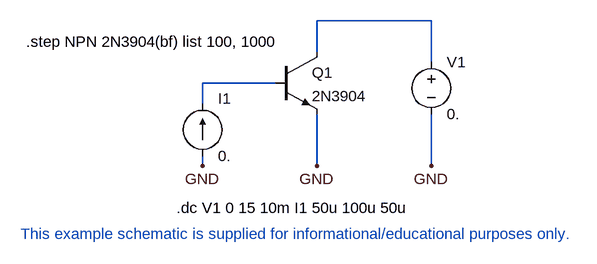
[diagram p0: schematic StepBeta.asc]
StepBeta.asc, the LTspice schematic file:
Version 4
SHEET 1 2488 1528
WIRE 1984 1376 1984 1296
WIRE 1984 1200 1984 1152
WIRE 1984 1152 2160 1152
WIRE 2160 1152 2160 1216
WIRE 2160 1296 2160 1376
WIRE 1808 1280 1808 1248
WIRE 1808 1248 1920 1248
WIRE 1808 1360 1808 1376
FLAG 2160 1376 GND
FLAG 1984 1376 GND
FLAG 1808 1376 GND
SYMBOL NPN 1920 1200 R0
SYMATTR InstName Q1
SYMATTR Value 2N3904
SYMBOL voltage 2160 1200 R0
SYMATTR InstName V1
SYMATTR Value 0.
SYMBOL CURRENT 1808 1360 M180
WINDOW 0 24 88 Left 0
WINDOW 3 24 0 Left 0
SYMATTR InstName I1
SYMATTR Value 0.
TEXT 1768 1440 Left 0 !.dc V1 0 15 10m I1 50u 100u 50u
TEXT 1528 1480 Left 0 ;This example schematic is supplied for informational/educational purposes only.
TEXT 1536 1184 Left 0 !.step NPN 2N3904(bf) list 100, 1000

The netlist it stands for:
* StepBeta.asc
Q1 N001 N002 GND 0 2N3904
V1 N001 GND 0.
I1 GND N002 0.
.model NPN NPN
.model PNP PNP
.lib standard.bjt
.dc V1 0 15 10m I1 50u 100u 50u
* This example schematic is supplied for informational/educational purposes only.
.step NPN 2N3904(bf) list 100, 1000
.backanno
.end